# Altium project project_konovalov_motor_driver.PrjPcb
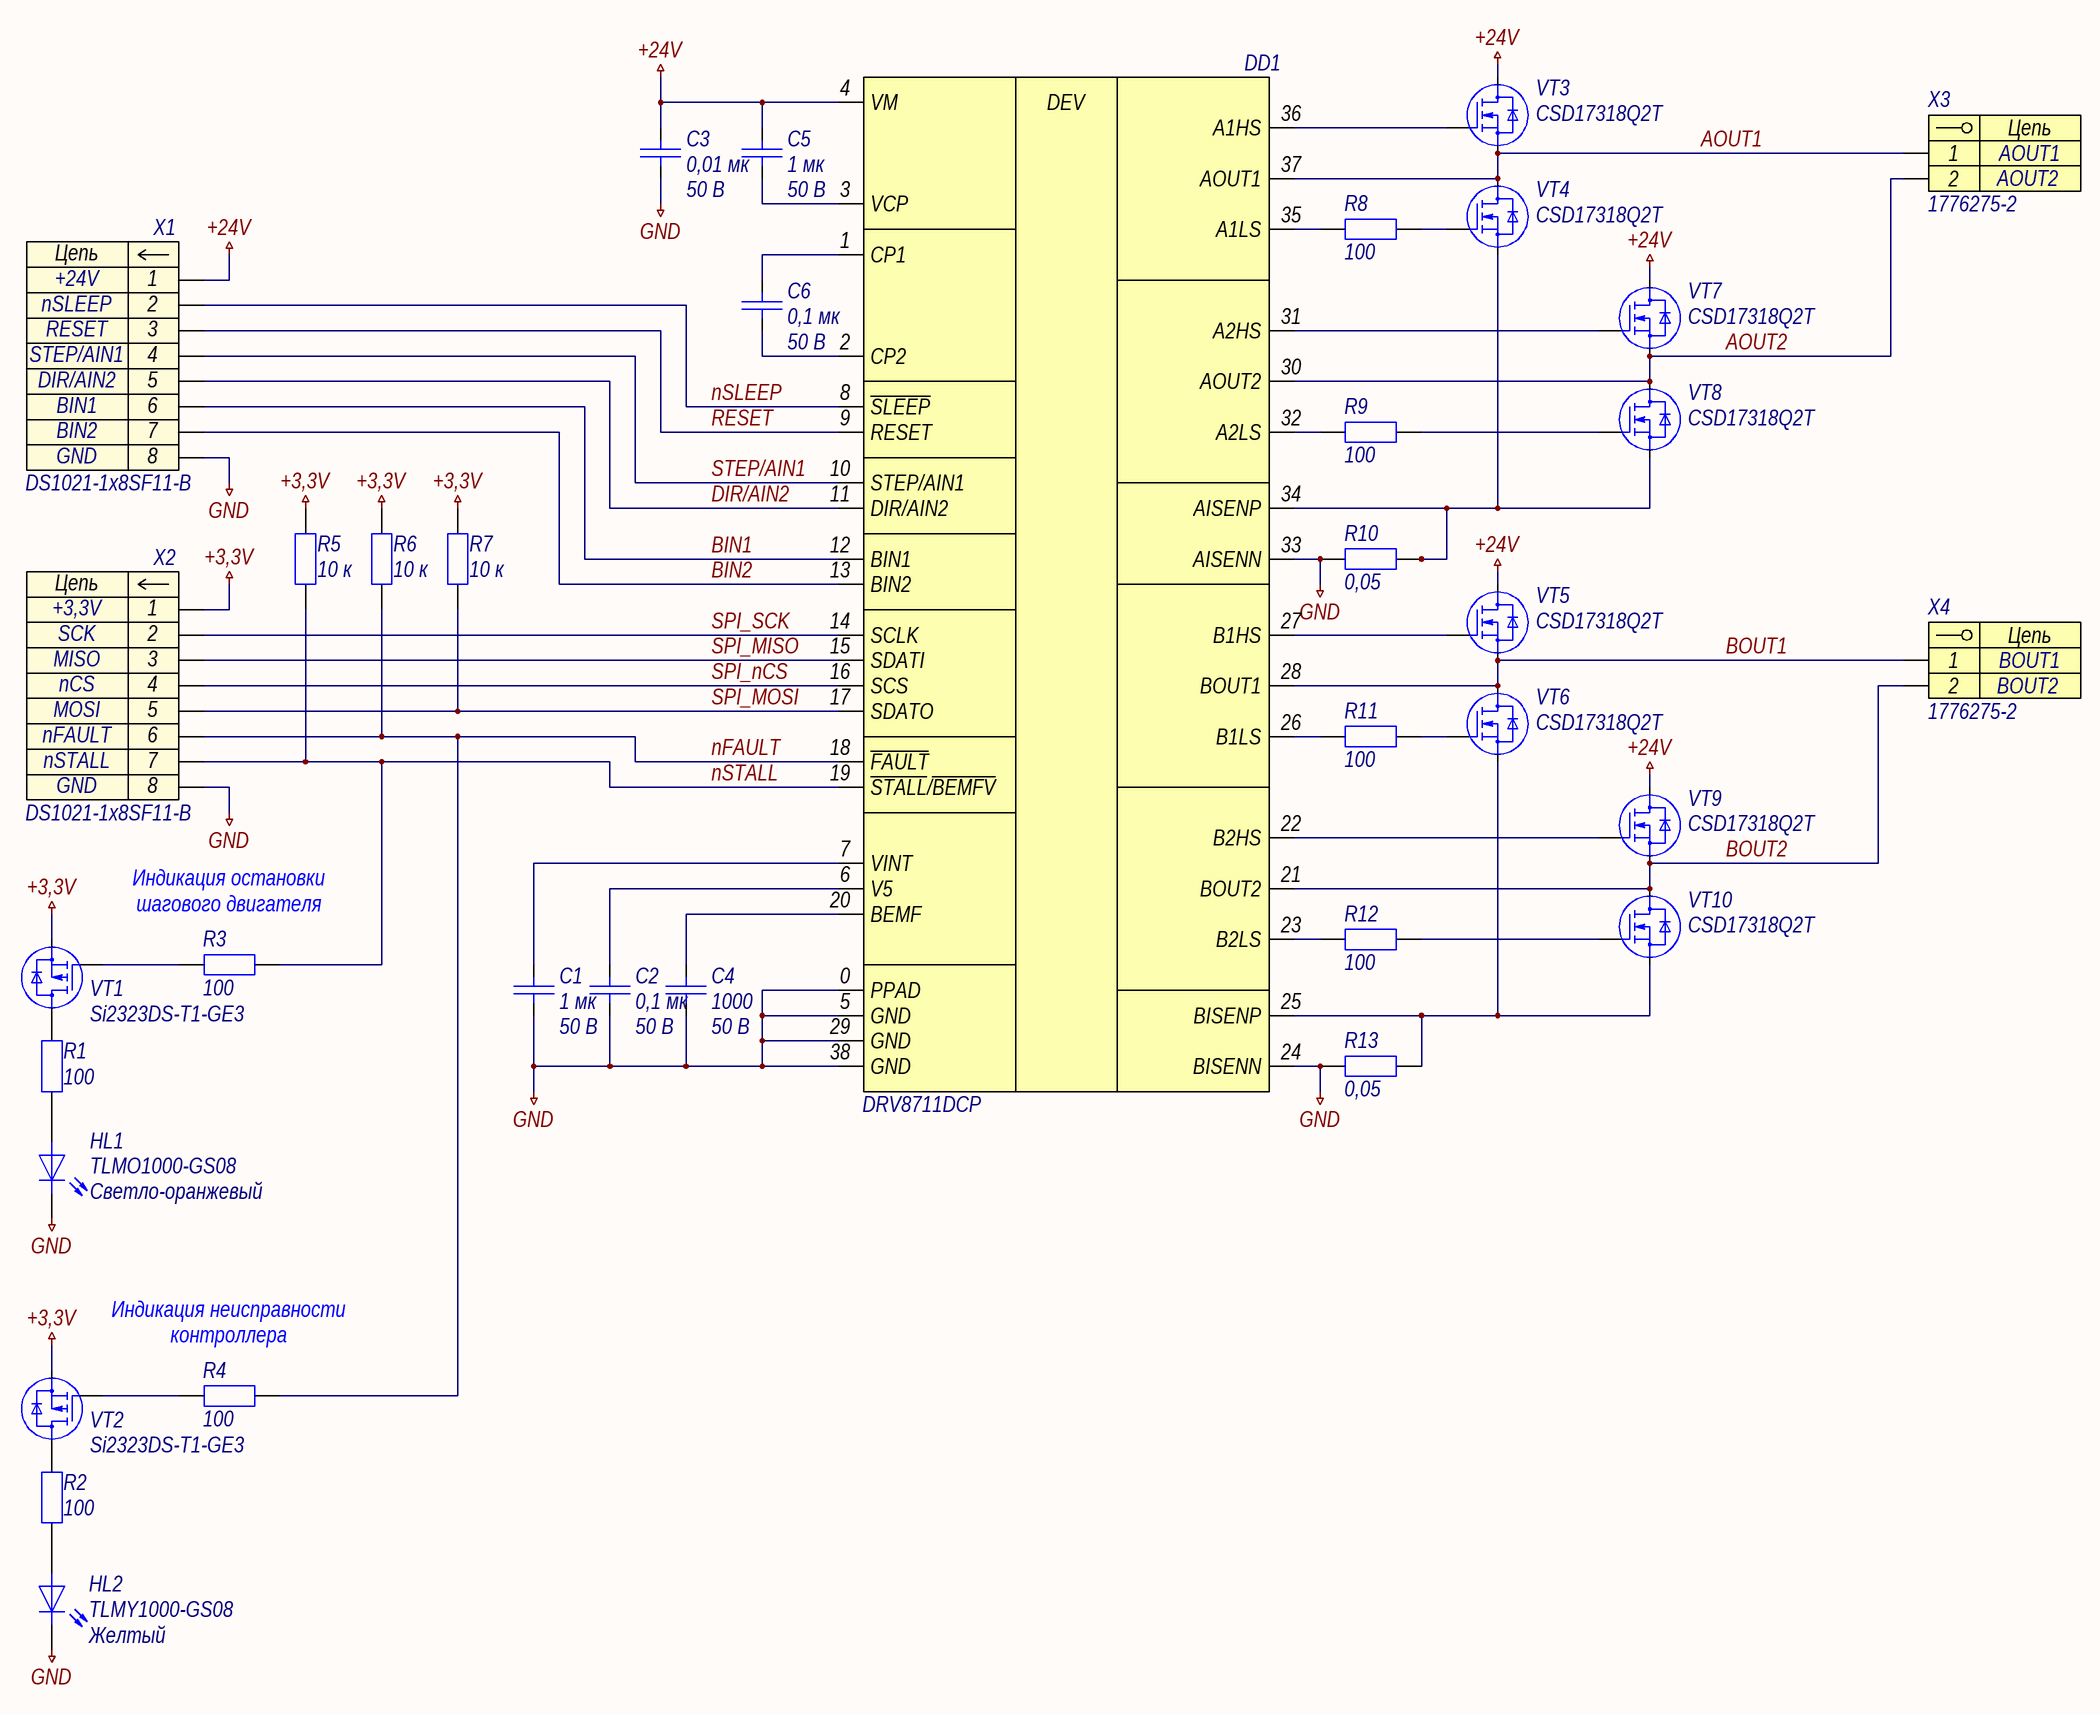
[diagram p0: project_konovalov_motor_driver.SchDoc]
approver: Капустин Д.А.; check: Капустин Д.А.; designation: СПБПУ.3331506.012; developer: Коновалов В.А.; document_code: Ý3; document_type: Схема электрическая принципиальная; pcb_dec_number: СПБПУ.3331506.012; project: Контроллер шагового двигателя; sheets_total: 1; title: Контроллер шагового двигателя; title_line_1: Контроллер; title_line_2: шагового двигателя
1 sheet, 36 parts. Net scope: global (net labels, ports and power ports of the same name join across sheets).
Board file: project_konovalov_motor_driver.PcbDoc

## Sheet project_konovalov_motor_driver.SchDoc: Контроллер шагового двигателя
size 594 x 420 mm; ApprovedBy: Капустин Д.А.; CheckedBy: Капустин Д.А.; DrawnBy: Коновалов В.А.; DocumentNumber: СПБПУ.3331506.012Ý3; SheetNumber: n; SheetTotal: 1; DocumentCode: Ý3; ImagePath: СПБПУ.3331506.012

### Parts
C1  1 мк  Напряжение: 50 В  [C0603]
C2  0,1 мк  Напряжение: 50 В  [C0603]
C3  0,01 мк  Напряжение: 50 В  [C0603]
C4  1000  Напряжение: 50 В  [C0603]
C5  1 мк  Напряжение: 50 В  [C0603]
C6  0,1 мк  Напряжение: 50 В  [C0603]
DD1  DRV8711DCP  [HTSSOP-38-P50-470X290X120-L63X22-T470X290]
HL1  TLMO1000-GS08  Цвет: Светло-оранжевый  [HL0603]
HL2  TLMY1000-GS08  Цвет: Желтый  [HL0603]
R1  100  [R0603]
R2  100  [R0603]
R3  100  [R0603]
R4  100  [R0603]
R5  10 к  [R0603]
R6  10 к  [R0603]
R7  10 к  [R0603]
R8  100  [R0603]
R9  100  [R0603]
R10  0,05  [R0603]
R11  100  [R0603]
R12  100  [R0603]
R13  0,05  [R0603]
VT1  Si2323DS-T1-GE3  [SOT-23-3-P95-292X237X112]
VT2  Si2323DS-T1-GE3  [SOT-23-3-P95-292X237X112]
VT3  CSD17318Q2T  [WSON-6-P65-200X200X80]
VT4  CSD17318Q2T  [WSON-6-P65-200X200X80]
VT5  CSD17318Q2T  [WSON-6-P65-200X200X80]
VT6  CSD17318Q2T  [WSON-6-P65-200X200X80]
VT7  CSD17318Q2T  [WSON-6-P65-200X200X80]
VT8  CSD17318Q2T  [WSON-6-P65-200X200X80]
VT9  CSD17318Q2T  [WSON-6-P65-200X200X80]
VT10  CSD17318Q2T  [WSON-6-P65-200X200X80]
X1  DS1021-1x8SF11-B  [DS1021-1X8SF11-B]
X2  DS1021-1x8SF11-B  [DS1021-1X8SF11-B]
X3  1776275-2  [1776275-2]
X4  1776275-2  [1776275-2]

### Nets
+3,3V: R5.2 R6.2 R7.2 VT1.S VT2.S X2.1
+24V: C3.1 C5.1 DD1.4(VM) VT3.D VT5.D VT7.D VT9.D X1.1
GND: C1.2 C2.2 C3.2 C4.2 DD1.0(PPAD) DD1.5(GND) DD1.24(BISENN) DD1.29(GND) DD1.33(AISENN) DD1.38(GND) HL1.1 HL2.1 R10.1 R13.1 X1.8 X2.8
AOUT1: DD1.37(AOUT1) VT3.S VT4.D X3.1
AOUT2: DD1.30(AOUT2) VT7.S VT8.D X3.2
BIN1: DD1.12(BIN1) X1.6
BIN2: DD1.13(BIN2) X1.7
BOUT1: DD1.28(BOUT1) VT5.S VT6.D X4.1
BOUT2: DD1.21(BOUT2) VT9.S VT10.D X4.2
DIR/AIN2: DD1.11(DIR/AIN2) X1.5
nFAULT: DD1.18(~{FAULT}) R4.2 R6.1 X2.6
nSLEEP: DD1.8(~{SLEEP}) X1.2
nSTALL: DD1.19(~{STALL}/~{BEMFV}) R3.2 R5.1 X2.7
RESET: DD1.9(RESET) X1.3
SPI_MISO: DD1.15(SDATI) X2.3
SPI_MOSI: DD1.17(SDATO) R7.1 X2.5
SPI_nCS: DD1.16(SCS) X2.4
SPI_SCK: DD1.14(SCLK) X2.2
STEP/AIN1: DD1.10(STEP/AIN1) X1.4
NetC1_1: C1.1 DD1.7(VINT)
NetC2_1: C2.1 DD1.6(V5)
NetC4_1: C4.1 DD1.20(BEMF)
NetC5_2: C5.2 DD1.3(VCP)
NetC6_1: C6.1 DD1.1(CP1)
NetC6_2: C6.2 DD1.2(CP2)
NetDD1_22: DD1.22(B2HS) VT9.G
NetDD1_23: DD1.23(B2LS) R12.1
NetDD1_25: DD1.25(BISENP) R13.2 VT6.S VT10.S
NetDD1_26: DD1.26(B1LS) R11.1
NetDD1_27: DD1.27(B1HS) VT5.G
NetDD1_31: DD1.31(A2HS) VT7.G
NetDD1_32: DD1.32(A2LS) R9.1
NetDD1_34: DD1.34(AISENP) R10.2 VT4.S VT8.S
NetDD1_35: DD1.35(A1LS) R8.1
NetDD1_36: DD1.36(A1HS) VT3.G
NetHL1_2: HL1.2 R1.1
NetHL2_2: HL2.2 R2.1
NetR1_2: R1.2 VT1.D
NetR2_2: R2.2 VT2.D
NetR3_1: R3.1 VT1.G
NetR4_1: R4.1 VT2.G
NetR8_2: R8.2 VT4.G
NetR9_2: R9.2 VT8.G
NetR11_2: R11.2 VT6.G
NetR12_2: R12.2 VT10.G

### Notes on the sheet
- Индикация остановки шагового двигателя
- Индикация неисправности контроллера
- Перв. примен.
- Справ. №
- Подп. и дата
- Инв. № дубл.
- Нормоконтроль:
- Взам. инв. №
- Изм.
- Лист
- № докум.
- Подп.
- Дата
- Лит.
- Масса
- Масштаб
- Т.контр.
- Пров.
- Разраб.
- Листов
- Разработал:
- Инв. № подл.
- Н.контр.
- Утв.
- Копировал
- Формат
- А2
- (in symbol dd0001) DEV
- (in symbol x0008) Цепь
- (in symbol x0029) Цепь

### Library data of the parts
C1 C5 = c0119: =Описание; ID: c0119; Фамилия: Паньков; Описание: Конденсатор керамический чип 0603 1 мкФ 50 В ±10 %; Наименование: CC0603KRX7R9BB105; Производитель: YAGEO Corp.; Отклонение: ±10 %; Рабочие температуры: от –55 °С до +125 °С; Температурный коэффициент емкости: X7R; Корпус: 0603; Номинал: 1 мк; Номинальное напряжение: 50 В; HelpURL: https://www.yageo.com/upload/media/product/productsearch/datasheet/mlcc/UPY-GPHC_X7R_6.3V-to-50V_20.pdf
C2 = c0088: =Описание; ID: c0088; Фамилия: Паньков; Описание: Конденсатор керамический чип 0603 100 нФ 50 В ±10 %; Наименование: CC0603KRX7R9BB104; Производитель: YAGEO Corp.; Отклонение: ±10 %; Рабочие температуры: от –55 °С до +125 °С; Температурный коэффициент емкости: X7R; Корпус: 0603; Номинал: 0,1 мк; Номинальное напряжение: 50 В; HelpURL: https://www.yageo.com/upload/media/product/productsearch/datasheet/mlcc/UPY-GPHC_X7R_6.3V-to-50V_20.pdf
C3 = c0036: =Описание; ID: c0036; Фамилия: Паньков; Описание: Конденсатор керамический чип 0603 10 нФ 50 В ±10 %; Наименование: CC0603KRX7R9BB103; Производитель: YAGEO Corp.; Отклонение: ±10 %; Рабочие температуры: от –55 °С до +125 °С; Температурный коэффициент емкости: X7R; Корпус: 0603; Номинал: 0,01 мк; Номинальное напряжение: 50 В; HelpURL: https://www.yageo.com/upload/media/product/productsearch/datasheet/mlcc/UPY-GPHC_X7R_6.3V-to-50V_20.pdf
C4 = c0038: =Описание; ID: c0038; Фамилия: Паньков; Описание: Конденсатор керамический чип 0603 1 нФ 50 В ±10 %; Наименование: CC0603KRX7R9BB102; Производитель: YAGEO Corp.; Отклонение: ±10 %; Рабочие температуры: от –55 °С до +125 °С; Температурный коэффициент емкости: X7R; Корпус: 0603; Номинал: 1000; Номинальное напряжение: 50 В; HelpURL: https://www.yageo.com/upload/media/product/productsearch/datasheet/mlcc/UPY-GPHC_X7R_6.3V-to-50V_20.pdf
C6 = c0060: =Описание; ID: c0060; Фамилия: Ларионов; Описание: Конденсатор керамический чип 0603 100 нФ 50 В ±5 %; Наименование: CC0603JRX7R9BB104; Производитель: YAGEO Corp.; Отклонение: ±5 %; Рабочие температуры: от –55 °С до +125 °С; Температурный коэффициент емкости: X7R; Корпус: 0603; Номинал: 0,1 мк; Номинальное напряжение: 50 В; HelpURL: https://www.yageo.com/upload/media/product/productsearch/datasheet/mlcc/UPY-GPHC_X7R_6.3V-to-50V_20.pdf
DD1 = dd0001: =Описание; ID: dd0001; Фамилия: Паньков; Описание: Драйвер биполярного шагового двигателя 1…256 микрошагов 52 В; Производитель: Texas Instruments Inc.; Рабочее напряжение: от 8 В до 52 В; Рабочий ток: 17 мА; Выходное напряжение: 5 В; Рабочие температуры: от –40 °С до +85 °С; Корпус: HTSSOP-38; Наименование: DRV8711DCP; HelpURL: https://www.ti.com/product/DRV8711
HL1 = hl0002: =Описание; ID: hl0002; Фамилия: Ларионов; Описание: Светодиод чип 0603 светло-оранжевый; Производитель: Vishay Intertechnology, Inc.; Номинальная сила света: 7,5 мкд; Номинальная длина волны: 605 нм; Номинальный прямой ток: 15 мА; Номинальное падение напряжения: 1,8 В; Рассеиваемая мощность: 40 мВт; Рабочие температуры: от –40 °С до +100 °С; Корпус: 0603; Наименование: TLMO1000-GS08; HelpURL: https://www.vishay.com/leds/list/product-83172/
HL2 = hl0003: =Описание; ID: hl0003; Фамилия: Ларионов; Описание: Светодиод чип 0603 желтый; Производитель: Vishay Intertechnology, Inc.; Номинальная сила света: 7,5 мкд; Номинальная длина волны: 588 нм; Номинальный прямой ток: 15 мА; Номинальное падение напряжения: 1,8 В; Рассеиваемая мощность: 40 мВт; Рабочие температуры: от –40 °С до +100 °С; Корпус: 0603; Наименование: TLMY1000-GS08; HelpURL: https://www.vishay.com/leds/list/product-83172/
R1-R4 R8 R9 R11 R12 = r0007: =Описание; ID: r0007; Фамилия: Самарин; Описание: Резистор чип 0603 100 Ом ±1 % 0,1 Вт; Наименование: RC0603FR‍‐07100RL; Производитель: YAGEO Corp.; Отклонение: ±1 %; Номинальное напряжение: 75 В; Номинальный ток: 1 А; Рабочие температуры: от –55 °С до +155 °С; Корпус: 0603; Примечание: Ряд E24; Номинал: 100; HelpURL: https://www.yageo.com/upload/media/product/productsearch/datasheet/rchip/PYu-RC_Group_51_RoHS_L_11.pdf
R5-R7 = r0060: =Описание; ID: r0060; Фамилия: Самарин; Описание: Резистор чип 0603 10 кОм ±1 % 0,1 Вт; Наименование: RC0603FR-0710KL; Производитель: YAGEO Corp.; Отклонение: ±1 %; Номинальное напряжение: 75 В; Номинальный ток: 1 А; Рабочие температуры: от –55 °С до +155 °С; Корпус: 0603; Примечание: Ряд E24; Номинал: 10 к; HelpURL: https://www.yageo.com/upload/media/product/productsearch/datasheet/rchip/PYu-RC_Group_51_RoHS_L_11.pdf
R10 R13 = r0002: =Описание; ID: r0002; Фамилия: Ларионов; Описание: Резистор чип 0603 50 мОм ±1 % 0,1 Вт; Наименование: RL0603FR-070R05L; Производитель: YAGEO Corp.; Отклонение: ±1 %; Номинальное напряжение: не указано; Номинальный ток: 2 А; Рабочие температуры: от –55 °С до +155 °С; Корпус: 0603; Номинал: 0,05; HelpURL: https://www.yageo.com/upload/media/product/productsearch/datasheet/rchip/PYu-RL_Group_521_RoHS_L_2.pdf
VT1 VT2 = vt0007: =Описание; ID: vt0007; Фамилия: Засецкий; Описание: Полевой P-канальный МДП-транзистор 20 В 4,7 А; Производитель: Vishay Intertechnology, Inc.; Напряжение затвор — исток: ±8 В; Напряжение сток — исток: –20 В; Ток стока: 4,7 А; Сопротивление сток — исток: 68 мОм; Рабочие температуры: от –55 °С до +150 °С; Корпус: SOT-23-3; Наименование: Si2323DS-T1-GE3; HelpURL: https://www.vishay.com/ppg?72024
VT3-VT10 = vt0003: =Описание; ID: vt0003; Фамилия: Паньков; Описание: Полевой N-канальный МДП-транзистор 30 В 10 А; Производитель: Texas Instruments Inc.; Напряжение затвор — исток: ±10 В; Напряжение сток — исток: 30 В; Ток стока: 10 А; Сопротивление сток — исток: 20 мОм; Рабочие температуры: от –55 °С до +150 °С; Корпус: WSON-6; Наименование: CSD17318Q2T; HelpURL: https://www.ti.com/product/CSD17318Q2
X1 = x0029: =Описание; Contact_1: +24V; Contact_2: nSLEEP; Contact_3: RESET; Contact_4: STEP/AIN1; Contact_5: DIR/AIN2; Contact_6: BIN1; Contact_7: BIN2; Contact_8: GND; ID: x0029; Фамилия: Паньков; Описание: PLS 8 pin 2,54 мм вилка прямой; Производитель: Connfly Electronic Co., Ltd.; Наименование: DS1021-1x8SF11-B; HelpURL: http://en.connfly.group/product/xVkr=EusQssAN0gN=Aos=mU+UrVkR9kqEAN0gN9g+WqANB+A
X2 = x0029: =Описание; Contact_1: +3,3V; Contact_2: SCK; Contact_3: MISO; Contact_4: nCS; Contact_5: MOSI; Contact_6: nFAULT; Contact_7: nSTALL; Contact_8: GND; ID: x0029; Фамилия: Паньков; Описание: PLS 8 pin 2,54 мм вилка прямой; Производитель: Connfly Electronic Co., Ltd.; Наименование: DS1021-1x8SF11-B; HelpURL: http://en.connfly.group/product/xVkr=EusQssAN0gN=Aos=mU+UrVkR9kqEAN0gN9g+WqANB+A
X3 = x0008: =Описание; Contact_1: AOUT1; Contact_2: AOUT2; ID: x0008; Фамилия: Паньков; Описание: Terminal Block 2 pin 3,5 мм; Производитель: TE Connectivity; Наименование: 1776275-2; HelpURL: https://www.te.com/usa-en/product-1776275-2.html
X4 = x0008: =Описание; Contact_1: BOUT1; Contact_2: BOUT2; ID: x0008; Фамилия: Паньков; Описание: Terminal Block 2 pin 3,5 мм; Производитель: TE Connectivity; Наименование: 1776275-2; HelpURL: https://www.te.com/usa-en/product-1776275-2.html